# Altium schematic sheet adc_dac_lo.SchDoc: mcHF Pro Transceiver UI board
size A3; Author: Krassi Atanassov; CompanyName: MØNKA; Engineer: For radio amateurs experimentation, non-commercial use only. Thank you!; Revision: 0.8.2; SheetTotal: 18
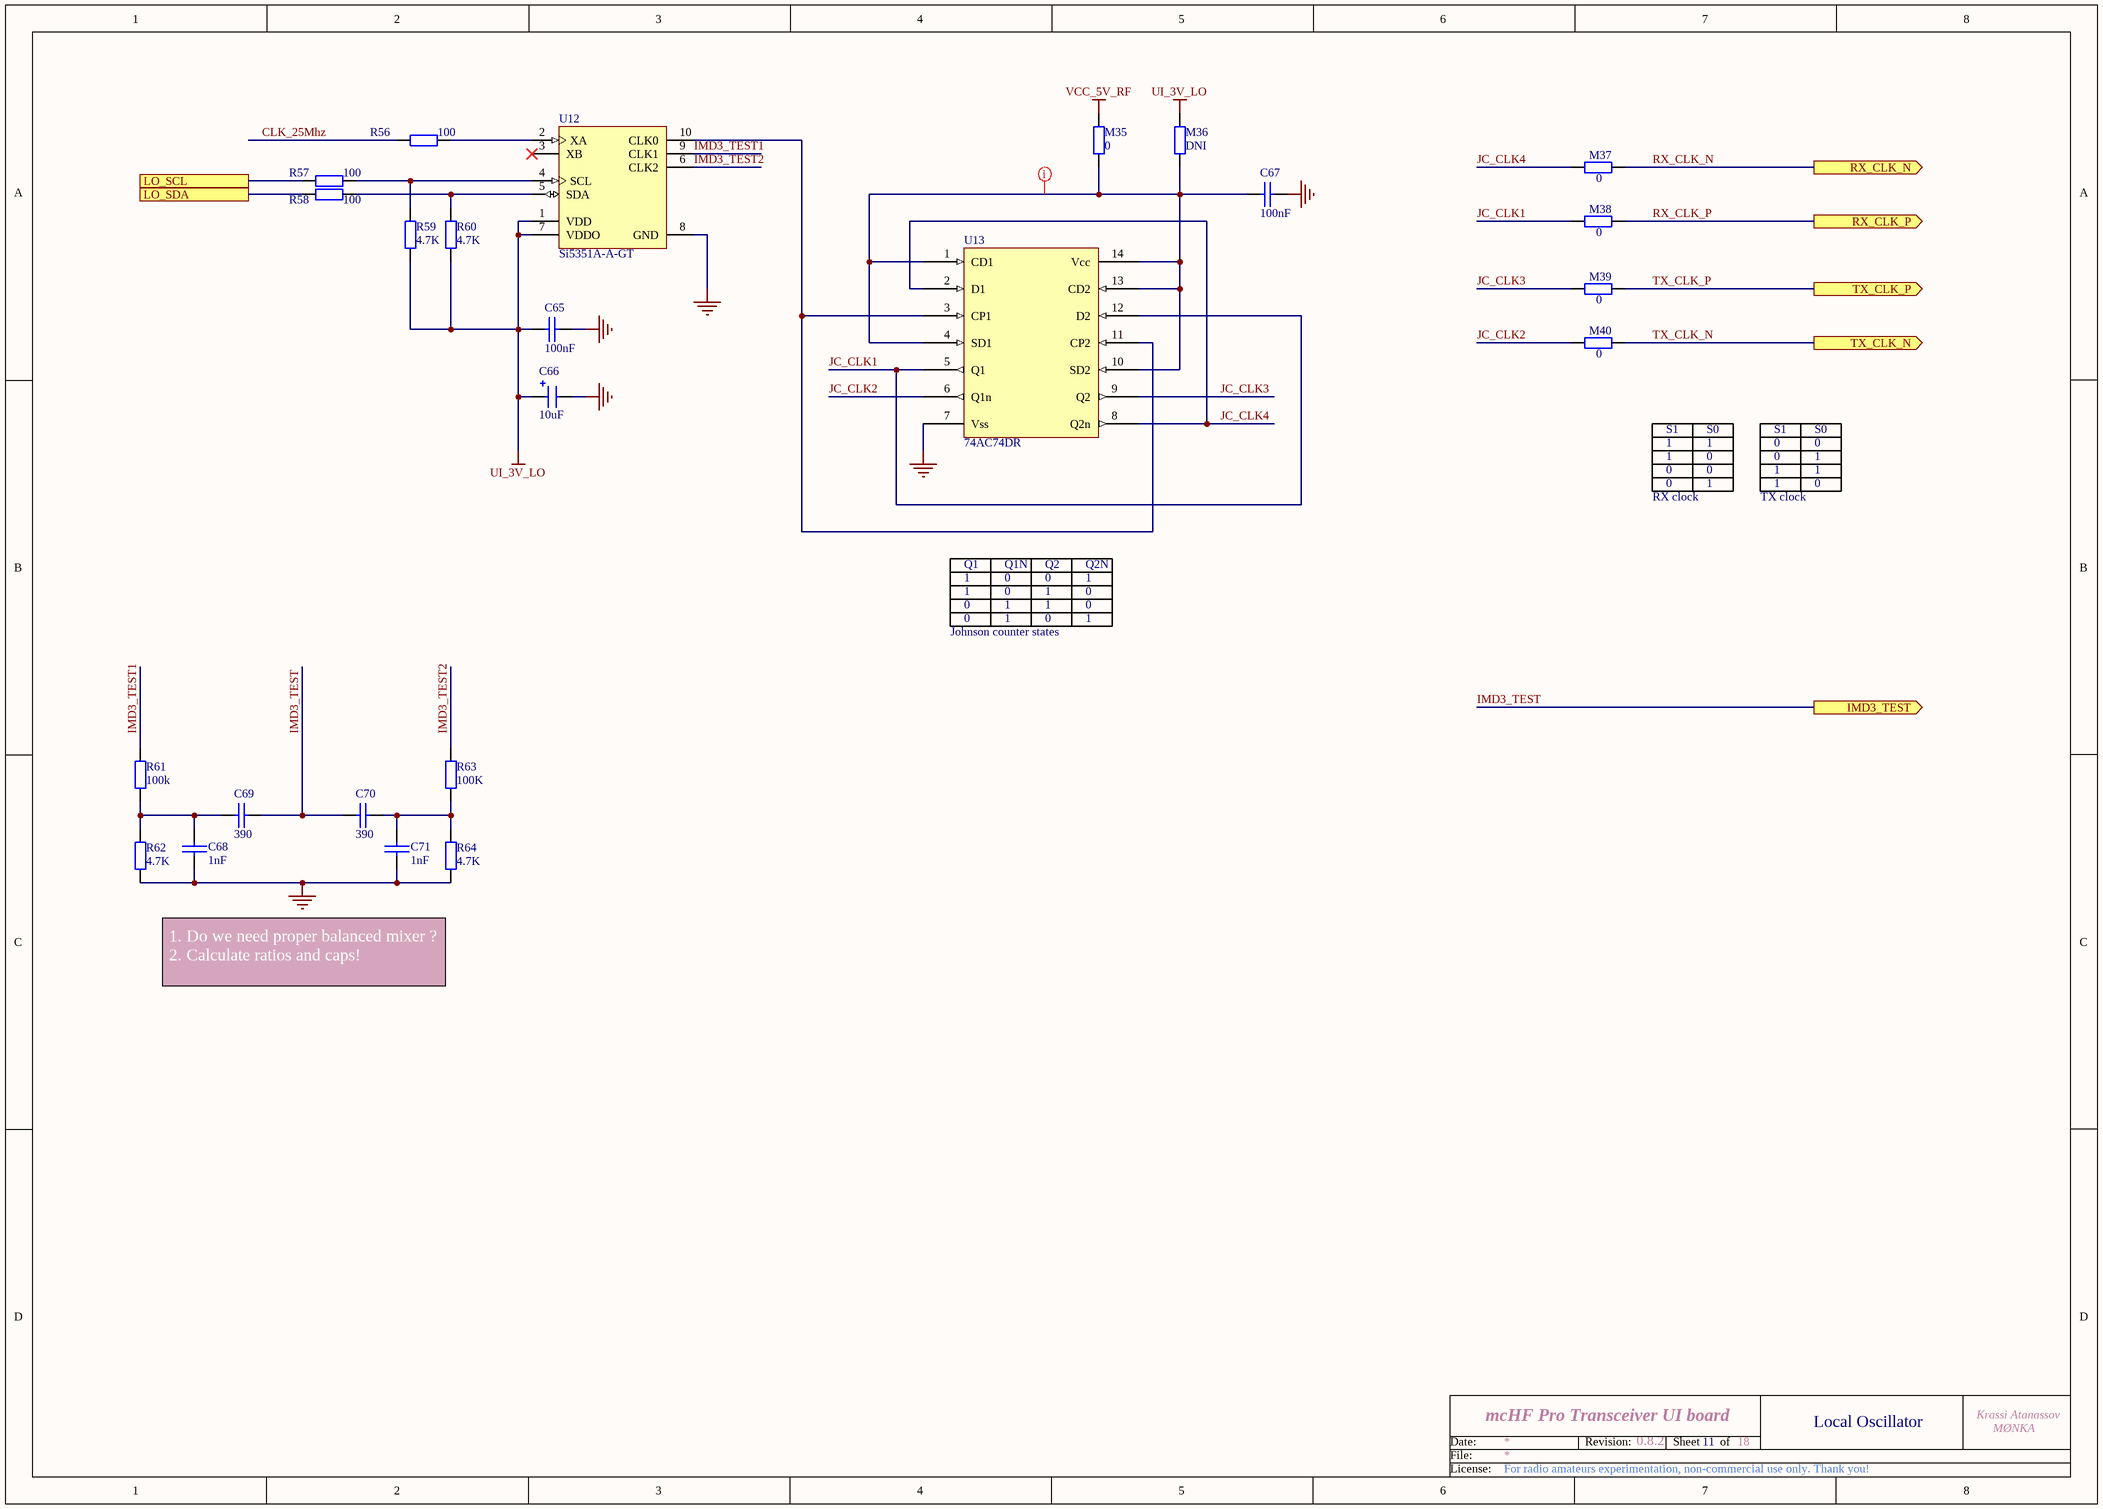
[diagram p0: adc_dac_lo.SchDoc]

## Parts
C65  100nF  [0805]
C66  10uF  [1206_Elec_Cap]
C67  100nF  [0805]
C68  1nF  [0805]
C69  390  [0805]
C70  390  [0805]
C71  1nF  [0805]
M35  0  [0805]
M36  DNI  [0805]  (no BOM)
M37  0  [0805]
M38  0  [0805]
M39  0  [0805]
M40  0  [0805]
R56  100  [0805]
R57  100  [0805]
R58  100  [0805]
R59  4.7K  [0805]
R60  4.7K  [0805]
R61  100k  [0805]
R62  4.7K  [0805]
R63  100K  [0805]
R64  4.7K  [0805]
U12  Si5351A-A-GT  [SLAB-MSOP-10_N]
U13  74AC74DR  [SO-14]

## Ports
IMD3_TEST (out), LO_SCL, LO_SDA, RX_CLK_N (out), RX_CLK_P (out), TX_CLK_N (out), TX_CLK_P (out)

## Nets
GND: C65.2 C66.2 C67.1 C68.2 C71.2 R62.2 R64.2 U12.8(GND) U13.7(Vss)
UI_3V_LO: C65.1 C66.1 M36.2 R59.2 R60.2 U12.1(VDD) U12.7(VDDO)
VCC_5V_RF: M35.2
CLK_25Mhz: R56.2
IMD3_TEST: C69.1 C70.2 ; port IMD3_TEST
IMD3_TEST1: R61.1 U12.9(CLK1)
IMD3_TEST2: R63.1 U12.6(CLK2)
JC_CLK1: M38.2 U13.5(Q1) U13.12(D2)
JC_CLK2: M40.2 U13.6(Q1n)
JC_CLK3: M39.2 U13.9(Q2)
JC_CLK4: M37.2 U13.2(D1) U13.8(Q2n)
LO_SCL: R57.2 ; port LO_SCL
LO_SDA: R58.2 ; port LO_SDA
RX_CLK_N: M37.1 ; port RX_CLK_N
RX_CLK_P: M38.1 ; port RX_CLK_P
TX_CLK_N: M40.1 ; port TX_CLK_N
TX_CLK_P: M39.1 ; port TX_CLK_P
NetC67_2: C67.2 M35.1 M36.1 U13.1(CD1) U13.4(SD1) U13.10(SD2) U13.13(CD2) U13.14(Vcc)
NetC68_1: C68.1 C69.2 R61.2 R62.1
NetC70_1: C70.1 C71.1 R63.2 R64.1
NetR56_1: R56.1 U12.2(XA)
NetR57_1: R57.1 R59.1 U12.4(SCL)
NetR58_1: R58.1 R60.1 U12.5(SDA)
NetU12_10: U12.10(CLK0) U13.3(CP1) U13.11(CP2)

Not connected (* = marked no-connect by the designer): U12 3(XB)*

## Layout directives
rule Width Constraint [Pref Width = 12mil    Min Width = 12mil    Max Width = 12mil]: NetC67_2

## Notes on the sheet
- S1
- 1
- S0
- 0
- RX clock
- TX clock
- Q1
- Q1N
- Q2
- Q2N
- Johnson counter states
- 1. Do we need proper balanced mixer ?    2. Calculate ratios and caps!
- 11
- Local Oscillator
- Date:
- File:
- Revision:
- Sheet
- of
- License:

## Library data of the parts
C65 C67 = CAP: Capacitor; Order: FN 252-2090; QT Order: QCC-00154; Price: 0.068
C66 = CAP-POL: Electrolitic capacitor; Order: FN 233-3009; QT Order: QCC-00166; Price: 0.204
C68 C71 = CAP: Capacitor
C69 C70 = CAP: Capacitor; Order: FN 233-2701; QT Order: QCC-00125; Price: 0.078
M35-M40 = RES: Resistor; Order: FN 933-3681; QT Order: QCR-00268; Price: 0.009
R56-R58 = RES: Resistor; Order: FN 933-2375; QT Order: QCR-00301; Price: 0.027
R59 R60 R62 R64 = RES: Resistor; Order: FN 200-8383; QT Order: QCR-00341; Price: 0.024
R61 R63 = RES: Resistor; Price: 0.024
U12 = Si5351A-A-GT: I2C-Programmable Any-Frequency CMOS Clock Generator + VCXO, 2.5 / 3.3 V, 0.008 to 160 MHz Output, -40 to 85 degC, 10-pin SOP; Manufacturer: Silicon Labs; Output Format: LVCMOS; Reference Inputs: 1; VDD: 2.5 V; 3.3 V; Sub-Family: Clock Generators; Notes: Farnell had it cheap (like 80 pence); DatasheetVersion: Rev. 0.95; PackageReference: MSOP-10; PackageDescription: 10-Pin Mini Small Outline Package, Body 3 x 3 mm, Pitch 0.5 mm; Supplier 1: Digi-Key; Supplier Part Number 1: 336-1994-5-ND; Supplier 2: Mouser; Supplier Part Number 2: 634-SI5351A-A-GT; Output Frequency (MHz): 0.008 to 160; Mounting Technology: Surface Mount; Code_JEDEC: MO-187; Code_IPC: J-STD-020; PartNumber: Si5351A-A-GT; ComponentLink1Description: Manufacturer URL; ComponentLink1URL: http://www.silabs.com/; ComponentLink2Description: Datasheet; ComponentLink2URL: http://www.silabs.com/Support%20Documents/TechnicalDocs/Si5351.pdf; ComponentLink3Description: Package Specification; ComponentLink3URL: http://www.silabs.com/Support Documents/TechnicalDocs/C8051T60x.pdf
U13 = 74LCX74M: Low Voltage Dual D-Type Positive Edge-Triggered  Flip-Flop with 5V Tolerant Inputs; Order: FN 985-3502; QT Order: QCI-00713; Notes: Can use PO74G74A, but remove M52, install M53; Price: 0.23